# Altium schematic sheet inverter.SchDoc: 3-Phase MOSFET Driver
size A3; SheetNumber: 7; SheetTotal: 18
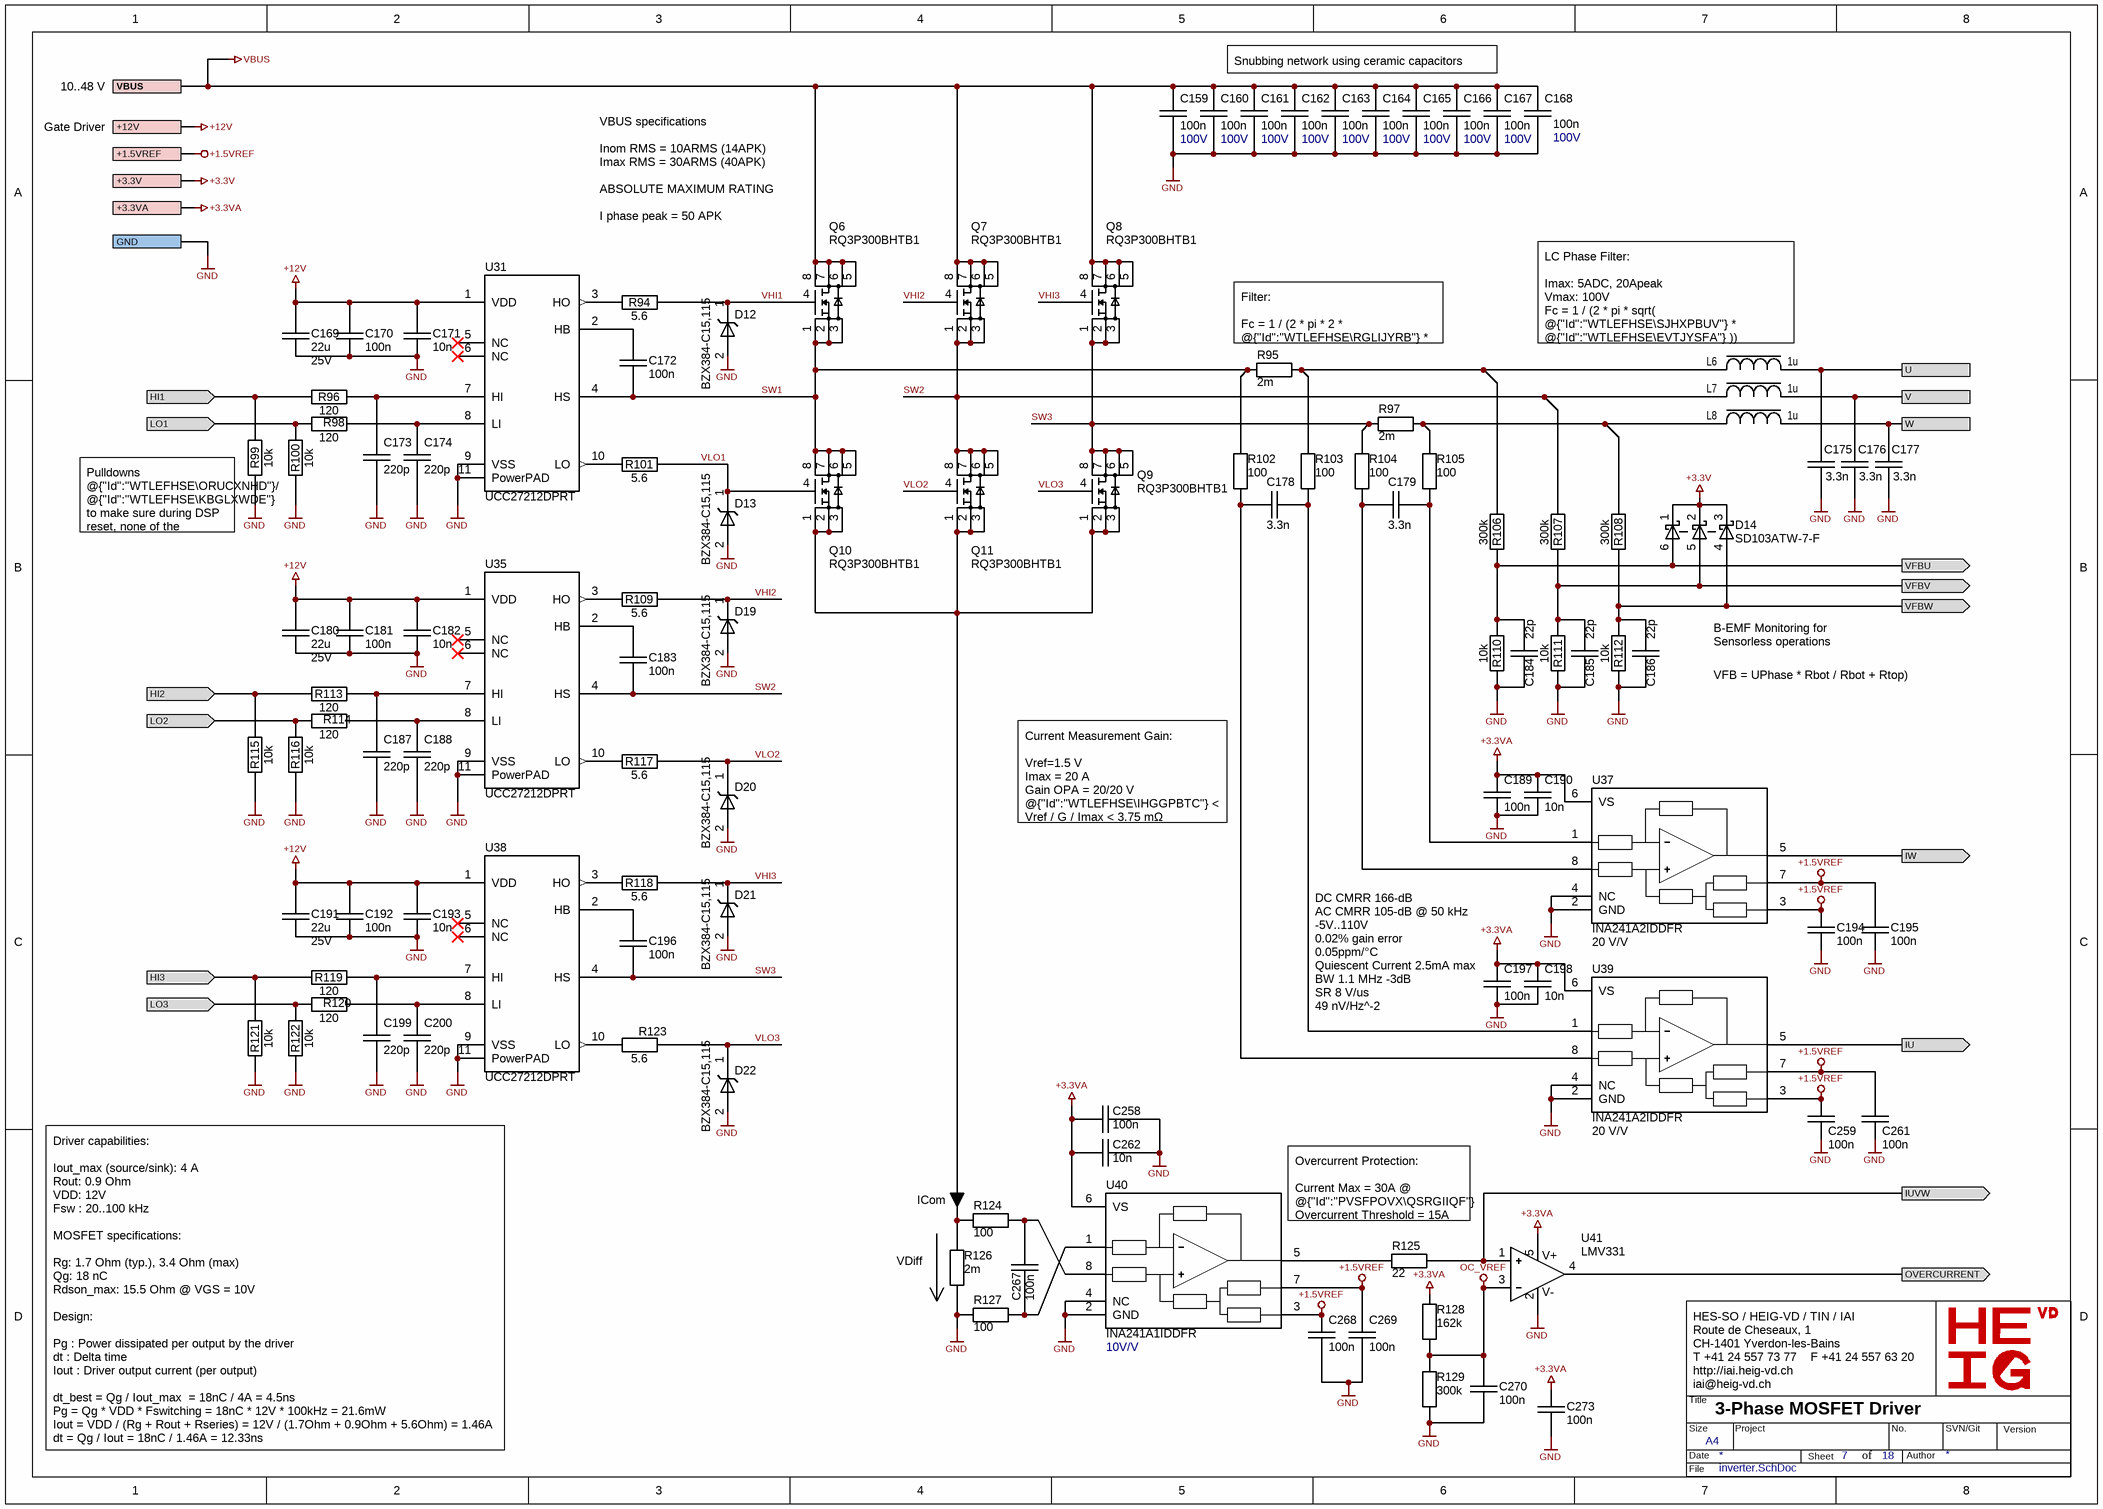
[diagram p0: inverter.SchDoc]

## Parts
C159  100n  Voltage: 100V  [SM/C1206]
C160  100n  Voltage: 100V  [SM/C1206]
C161  100n  Voltage: 100V  [SM/C1206]
C162  100n  Voltage: 100V  [SM/C1206]
C163  100n  Voltage: 100V  [SM/C1206]
C164  100n  Voltage: 100V  [SM/C1206]
C165  100n  Voltage: 100V  [SM/C1206]
C166  100n  Voltage: 100V  [SM/C1206]
C167  100n  Voltage: 100V  [SM/C1206]
C168  100n  Voltage: 100V  [SM/C1206]
C169  22u  Voltage: 25V  [SM/C0805]
C170  100n  [SM/C0402]
C171  10n  [SM/C0402]
C172  100n  [SM/C0402]
C173  220p  [SM/C0402]
C174  220p  [SM/C0402]
C175  3.3n  [SM/C0402]
C176  3.3n  [SM/C0402]
C177  3.3n  [SM/C0402]
C178  3.3n  [SM/C0402]
C179  3.3n  [SM/C0402]
C180  22u  Voltage: 25V  [SM/C0805]
C181  100n  [SM/C0402]
C182  10n  [SM/C0402]
C183  100n  [SM/C0402]
C184  22p  [SM/C0402]
C185  22p  [SM/C0402]
C186  22p  [SM/C0402]
C187  220p  [SM/C0402]
C188  220p  [SM/C0402]
C189  100n  [SM/C0402]
C190  10n  [SM/C0402]
C191  22u  Voltage: 25V  [SM/C0805]
C192  100n  [SM/C0402]
C193  10n  [SM/C0402]
C194  100n  [SM/C0402]
C195  100n  [SM/C0402]
C196  100n  [SM/C0402]
C197  100n  [SM/C0402]
C198  10n  [SM/C0402]
C199  220p  [SM/C0402]
C200  220p  [SM/C0402]
C258  100n  [SM/C0402]
C259  100n  [SM/C0402]
C261  100n  [SM/C0402]
C262  10n  [SM/C0402]
C267  100n  [SM/C0402]
C268  100n  [SM/C0402]
C269  100n  [SM/C0402]
C270  100n  [SM/C0402]
C273  100n  [SM/C0402]
D12  BZX384-C15,115  [SODFL250X110-2N]
D13  BZX384-C15,115  [SODFL250X110-2N]
D14  SD103ATW-7-F  [SC70-6]
D19  BZX384-C15,115  [SODFL250X110-2N]
D20  BZX384-C15,115  [SODFL250X110-2N]
D21  BZX384-C15,115  [SODFL250X110-2N]
D22  BZX384-C15,115  [SODFL250X110-2N]
L6  1u  [PA5005.102NLT]
L7  1u  [PA5005.102NLT]
L8  1u  [PA5005.102NLT]
Q6  RQ3P300BHTB1  [RQ3P300BHTB1]
Q7  RQ3P300BHTB1  [RQ3P300BHTB1]
Q8  RQ3P300BHTB1  [RQ3P300BHTB1]
Q9  RQ3P300BHTB1  [RQ3P300BHTB1]
Q10  RQ3P300BHTB1  [RQ3P300BHTB1]
Q11  RQ3P300BHTB1  [RQ3P300BHTB1]
R94  5.6  [SM/R0402]
R95  2m  [SM/R1206]
R96  120  [SM/R0402]
R97  2m  [SM/R1206]
R98  120  [SM/R0402]
R99  10k  [SM/R0402]
R100  10k  [SM/R0402]
R101  5.6  [SM/R0402]
R102  100  [SM/R0402]
R103  100  [SM/R0402]
R104  100  [SM/R0402]
R105  100  [SM/R0402]
R106  300k  [SM/R0402]
R107  300k  [SM/R0402]
R108  300k  [SM/R0402]
R109  5.6  [SM/R0402]
R110  10k  [SM/R0402]
R111  10k  [SM/R0402]
R112  10k  [SM/R0402]
R113  120  [SM/R0402]
R114  120  [SM/R0402]
R115  10k  [SM/R0402]
R116  10k  [SM/R0402]
R117  5.6  [SM/R0402]
R118  5.6  [SM/R0402]
R119  120  [SM/R0402]
R120  120  [SM/R0402]
R121  10k  [SM/R0402]
R122  10k  [SM/R0402]
R123  5.6  [SM/R0402]
R124  100  [SM/R0402]
R125  22  [SM/R0402]
R126  2m  [SM/R1206]
R127  100  [SM/R0402]
R128  162k  [SM/R0402]
R129  300k  [SM/R0402]
U31  UCC27212DPRT  [PSON80P400X80_HS-11N]
U35  UCC27212DPRT  [PSON80P400X80_HS-11N]
U37  INA241A2IDDFR  Gain: 20 V/V  [SOT65P280X110-8N]
U38  UCC27212DPRT  [PSON80P400X80_HS-11N]
U39  INA241A2IDDFR  Gain: 20 V/V  [SOT65P280X110-8N]
U40  INA241A1IDDFR  Gain: 10V/V  [SOT65P280X110-8N]
U41  LMV331  [SOT23-5]

## Ports
+1.5VREF, +3.3V, +3.3VA, +12V, GND, HI1 (in), HI2 (in), HI3 (in), IU (out), IUVW (out), IW (out), LO1 (in), LO2 (in), LO3 (in), OVERCURRENT (out), U, V, VBUS, VFBU (out), VFBV (out), VFBW (out), W

## Nets
+1.5VREF: C194.2 C195.2 C259.2 C261.2 C268.2 C269.2 U37.3(REF2) U37.7(REF1) U39.3(REF2) U39.7(REF1) U40.3(REF2) U40.7(REF1) ; port +1.5VREF
+3.3V: D14.1(K) D14.2(K) D14.3(K) ; port +3.3V
+3.3VA: C189.2 C190.1 C197.2 C198.1 C258.2 C262.1 C273.2 R128.2 U37.6(VS) U39.6(VS) U40.6(VS) U41.5(V+) ; port +3.3VA
+12V: C169.2 C170.2 C171.1 C180.2 C181.2 C182.1 C191.2 C192.2 C193.1 U31.1(VDD) U35.1(VDD) U38.1(VDD) ; port +12V
GND: C159.1 C160.1 C161.1 C162.1 C163.1 C164.1 C165.1 C166.1 C167.1 C168.1 C169.1 C170.1 C171.2 C173.1 C174.1 C175.1 C176.1 C177.1 C180.1 C181.1 C182.2 C184.1 C185.1 C186.1 C187.1 C188.1 C189.1 C190.2 C191.1 C192.1 C193.2 C194.1 C195.1 C197.1 C198.2 C199.1 C200.1 C258.1 C259.1 C261.1 C262.2 C268.1 C269.1 C270.1 C273.1 D12.2(A) D13.2(A) D19.2(A) D20.2(A) D21.2(A) D22.2(A) R99.2 R100.2 R110.1 R111.1 R112.1 R115.2 R116.2 R121.2 R122.2 R126.1 R127.2 R129.1 U31.9(VSS) U31.11(PowerPAD) U35.9(VSS) U35.11(PowerPAD) U37.2(GND) U37.4(NC) U38.9(VSS) U38.11(PowerPAD) U39.2(GND) U39.4(NC) U40.2(GND) U40.4(NC) U41.2(V-) ; port GND
OC_VREF: C270.2 R128.1 R129.2 U41.3(IN-)
VBUS: C159.2 C160.2 C161.2 C162.2 C163.2 C164.2 C165.2 C166.2 C167.2 C168.2 Q6.5(D) Q6.6(D) Q6.7(D) Q6.8(D) Q7.5(D) Q7.6(D) Q7.7(D) Q7.8(D) Q8.5(D) Q8.6(D) Q8.7(D) Q8.8(D) ; port VBUS
HI1: R96.2 R99.1 ; port HI1
HI2: R113.2 R115.1 ; port HI2
HI3: R119.2 R121.1 ; port HI3
IU: U39.5(OUT) ; port IU
IUVW: R125.1 U41.1(IN+) ; port IUVW
IW: U37.5(OUT) ; port IW
LO1: R98.2 R100.1 ; port LO1
LO2: R114.2 R116.1 ; port LO2
LO3: R120.2 R122.1 ; port LO3
OVERCURRENT: U41.4(OUT) ; port OVERCURRENT
SW1: C172.2 Q6.1(S) Q6.2(S) Q6.3(S) Q10.5(D) Q10.6(D) Q10.7(D) Q10.8(D) R95.1 R102.2 U31.4(HS)
SW2: C183.2 L7.1 Q7.1(S) Q7.2(S) Q7.3(S) Q11.5(D) Q11.6(D) Q11.7(D) Q11.8(D) R107.2 U35.4(HS)
SW3: C196.2 Q8.1(S) Q8.2(S) Q8.3(S) Q9.5(D) Q9.6(D) Q9.7(D) Q9.8(D) R97.1 R104.2 U38.4(HS)
U: C175.2 L6.2 ; port U
V: C176.2 L7.2 ; port V
VFBU: C184.2 D14.6(A) R106.1 R110.2 ; port VFBU
VFBV: C185.2 D14.5(A) R107.1 R111.2 ; port VFBV
VFBW: C186.2 D14.4(A) R108.1 R112.2 ; port VFBW
VHI1: D12.1(K) Q6.4(G) R94.2
VHI2: D19.1(K) Q7.4(G) R109.2
VHI3: D21.1(K) Q8.4(G) R118.2
VLO1: D13.1(K) Q10.4(G) R101.1
VLO2: D20.1(K) Q11.4(G) R117.1
VLO3: D22.1(K) Q9.4(G) R123.1
W: C177.2 L8.2 ; port W
NetC172_1: C172.1 U31.2(HB)
NetC173_2: C173.2 R96.1 U31.7(HI)
NetC174_2: C174.2 R98.1 U31.8(LI)
NetC178_1: C178.1 R102.1 U39.8(IN+)
NetC178_2: C178.2 R103.1 U39.1(IN-)
NetC179_1: C179.1 R104.1 U37.8(IN+)
NetC179_2: C179.2 R105.1 U37.1(IN-)
NetC183_1: C183.1 U35.2(HB)
NetC187_2: C187.2 R113.1 U35.7(HI)
NetC188_2: C188.2 R114.1 U35.8(LI)
NetC196_1: C196.1 U38.2(HB)
NetC199_2: C199.2 R119.1 U38.7(HI)
NetC200_2: C200.2 R120.1 U38.8(LI)
NetC267_1: C267.1 R127.1 U40.1(IN-)
NetC267_2: C267.2 R124.1 U40.8(IN+)
NetL6_1: L6.1 R95.2 R103.2 R106.2
NetL8_1: L8.1 R97.2 R105.2 R108.2
NetQ9_1: Q9.1(S) Q9.2(S) Q9.3(S) Q10.1(S) Q10.2(S) Q10.3(S) Q11.1(S) Q11.2(S) Q11.3(S) R124.2 R126.2
NetR94_1: R94.1 U31.3(HO)
NetR101_2: R101.2 U31.10(LO)
NetR109_1: R109.1 U35.3(HO)
NetR117_2: R117.2 U35.10(LO)
NetR118_1: R118.1 U38.3(HO)
NetR123_2: R123.2 U38.10(LO)
NetR125_2: R125.2 U40.5(OUT)

Not connected (* = marked no-connect by the designer): U31 5(NC)* 6(NC)*; U35 5(NC)* 6(NC)*; U38 5(NC)* 6(NC)*

## Notes on the sheet
- 10..48 V
- Snubbing network using ceramic capacitors
- Gate Driver
- VBUS specifications
  Inom RMS = 10ARMS (14APK)
  Imax RMS = 30ARMS (40APK)
  ABSOLUTE MAXIMUM RATING
  I phase peak = 50 APK
- (near R95) Filter:
  Fc = 1 / (2 * pi * 2 * @{"Id":"WTLEFHSE\RGLIJYRB"} * @{"Id":"WTLEFHSE\LUPZFQRW"} )
- (near L6) LC Phase Filter:
  Imax: 5ADC, 20Apeak
  Vmax: 100V
  Fc = 1 / (2 * pi * sqrt( @{"Id":"WTLEFHSE\SJHXPBUV"} * @{"Id":"WTLEFHSE\EVTJYSFA"} ))
  Fc = 1 / (2 * pi * sqrt(1uH * 3.3nF)) = 2.7MHz
- (near R99) Pulldowns @{"Id":"WTLEFHSE\ORUCXNHD"}/ @{"Id":"WTLEFHSE\KBGLXWDE"} to make sure during DSP reset, none of the MOSFET would be ON.
- VFB = UPhase * Rbot / Rbot + Rtop)
- B-EMF Monitoring for Sensorless operations
- Current Measurement Gain:
  Vref=1.5 V
  Imax = 20 A
  Gain OPA = 20/20 V
  @{"Id":"WTLEFHSE\IHGGPBTC"} < Vref / G / Imax < 3.75 mΩ
- (near C197) DC CMRR 166-dB
  AC CMRR 105-dB @ 50 kHz
  -5V..110V
  0.02% gain error
  0.05ppm/°C
  Quiescent Current 2.5mA max
  BW 1.1 MHz -3dB
  SR 8 V/us
  49 nV/Hz^-2
- (near R126) VDiff
- ICom
- (near U40) Overcurrent Protection:
  Current Max = 30A @ @{"Id":"PVSFPOVX\QSRGIIQF"}
  Overcurrent Threshold = 15A
- Driver capabilities:
  Iout_max (source/sink): 4 A
  Rout: 0.9 Ohm
  VDD: 12V
  Fsw : 20..100 kHz
  MOSFET specifications:
  Rg: 1.7 Ohm (typ.), 3.4 Ohm (max)
  Qg: 18 nC
  Rdson_max: 15.5 Ohm @ VGS = 10V
  Design:
  Pg : Power dissipated per output by the driver
  dt : Delta time
  Iout : Driver output current (per output)
  dt_best = Qg / Iout_max  = 18nC / 4A = 4.5ns
  Pg = Qg * VDD * Fswitching = 18nC * 12V * 100kHz = 21.6mW
  Iout = VDD / (Rg + Rout + Rseries) = 12V / (1.7Ohm + 0.9Ohm + 5.6Ohm) = 1.46A
  dt = Qg / Iout = 18nC / 1.46A = 12.33ns
- HES-SO / HEIG-VD / TIN / IAI
  Route de Cheseaux, 1
  CH-1401 Yverdon-les-Bains
  T +41 24 557 73 77    F +41 24 557 63 20
  http://iai.heig-vd.ch
  iai@heig-vd.ch
- Title
- Size
- Date
- A4
- Project
- Sheet
- of
- No.
- Author
- SVN/Git
- Version
- File

## Library data of the parts
C159-C168 = CAP CER 100NF 100V C0G 1206: 100 nF ±5% 100V Ceramic Capacitor C0G, NP0 1206 (3216 Metric); Dielectric: NPO; Supplier 1: Digi-Key; Supplier Part Number 1: 445-172677-1-ND; Value: 100n
C169 C180 C191 = CAP CER 22UF 25V X5R 0805: 22 µF ±20% 25V Ceramic Capacitor X5R 0805 (2012 Metric); Dielectric: X5R; Supplier 1: Digi-Key; Supplier Part Number 1: 490-14661-1-ND
C170 C172 C181 C183 C189 C192 C194-C197 C258 C259 C261 C267-C270 C273 = CAP CER 100NF 25V X5R 0402: 100 nF ±10% 25V Ceramic Capacitor X5R 0402 (1005 Metric); Voltage: 25V; Dielectric: X5R; Supplier 1: Digi-Key; Supplier Part Number 1: 1276-1043-1-ND; Value: 100n
C171 C182 C190 C193 C198 C262 = CAP CER 10NF 50V X7R 0402: 10 nF ±10% 50V Ceramic Capacitor X7R 0402 (1005 Metric); Voltage: 50V; Dielectric: X7R; Supplier 1: Digi-Key; Supplier Part Number 1: 1276-1028-1-ND; Value: 10n
C173 C174 C187 C188 C199 C200 = CAP CER 220PF 50V C0G/NP0 0402: 220 pF ±5% 50V Ceramic Capacitor C0G, NP0 0402 (1005 Metric); Dielectric: NPO; Voltage: 50V; Supplier 1: Digi-Key; Supplier Part Number 1: 1276-1059-1-ND; Value: 220p
C175-C179 = CAP CER 3.3NF 100V X8R 0402: 3.3 nF ±10% 100V Ceramic Capacitor X8R 0402 (1005 Metric); Voltage: 16V; Dielectric: X7R; Supplier 1: Digi-Key; Supplier Part Number 1: 445-15951-1-ND; Value: 3.3n
C184-C186 = CAP CER 22PF 50V C0G/NPO 0402: 22 pF ±2% 50V Ceramic Capacitor C0G, NP0 0402 (1005 Metric); Dielectric: NPO; Voltage: 50V; Supplier 1: Digi-Key; Supplier Part Number 1: 311-1652-1-ND; Value: 22p
D12 D13 D19-D22 = DIODE ZENER 15V 300MW SOD323: Zener Diode 15 V 300 mW ±5% Surface Mount SOD-323; Mounting: SMD; Supplier 1: Digi-Key; Supplier Part Number 1: 1727-4986-1-ND
D14 = SD103ATW-7-F: DIODE ARRAY SCHOTTKY 40V SOT363 / Diode Array 3 Independent Schottky 40 V 175mA Surface Mount 6-TSSOP, SC-88, SOT-363; Supplier 1: Digi-Key; Supplier Part Number 1: SD103ATW-FDICT-ND
L6-L8 = PA5005.102NLT: 1 µH Shielded Molded Inductor 20 A 4.52mOhm Max Nonstandard; Isat: 23A; Value: 1u; Supplier 1: Digi-Key; Supplier Part Number 1: 553-4098-1-ND
Q6-Q11 = RQ3P300BHTB1: N-Channel 100 V 39A (Ta) 2W (Ta) Surface Mount 8-HSMT (3.2x3); Supplier 1: Digi-Key; Supplier Part Number 1: 846-RQ3P300BHTB1CT-ND
R94 R101 R109 R117 R118 R123 = RES 5.6 OHM 5% 1/16W 0402: 5.6 Ohms ±5% 0.063W, 1/16W Chip Resistor 0402 (1005 Metric) Moisture Resistant Thick Film; Supplier 1: Digi-Key; Supplier Part Number 1: 311-5.6JRCT-ND; Value: 5.6
R95 R97 R126 = RES 0.002 OHM 1% 1W 1206: 2 mOhms ±1% 1W Chip Resistor 1206 (3216 Metric) Current Sense, Moisture Resistant Metal Element; Supplier 1: Digi-Key; Supplier Part Number 1: CSNL1206FT2L00CT-ND; Value: 2m
R96 R98 R113 R114 R119 R120 = RES 120 OHM 1% 1/16W 0402: 120 Ohms ±1% 0.063W, 1/16W Chip Resistor 0402 (1005 Metric) Moisture Resistant Thick Film; Supplier 1: Digi-Key; Supplier Part Number 1: 311-120LRCT-ND; Value: 120
R99 R100 R110-R112 R115 R116 R121 R122 = RES 10K OHM 1% 1/16W 0402: 10 kOhms ±1% 0.063W, 1/16W Chip Resistor 0402 (1005 Metric) Moisture Resistant Thick Film; Supplier 1: Digi-Key; Supplier Part Number 1: 1276-3431-1-ND; Value: 10k
R102-R105 R124 R127 = RES 100 OHM 1% 1/16W 0402: 100 Ohms ±1% 0.063W, 1/16W Chip Resistor 0402 (1005 Metric) Moisture Resistant Thick Film; Supplier 1: Digi-Key; Supplier Part Number 1: 13-RC0402FR-13100RLCT-ND; Value: 100
R106-R108 R129 = RES 300K OHM 1% 1/16W 0402: 300 kOhms ±1% 0.063W, 1/16W Chip Resistor 0402 (1005 Metric) Moisture Resistant Thick Film; Value: 300k; Supplier 1: Digi-Key; Supplier Part Number 1: 311-300KLRCT-ND
R125 = RES 22 OHM 1% 1/16W 0402: 22 Ohms ±1% 0.063W, 1/16W Chip Resistor 0402 (1005 Metric) Moisture Resistant Thick Film; Value: 22; Supplier 1: Digi-Key; Supplier Part Number 1: 311-22.0LRCT-ND
R128 = RES 162K OHM 1% 1/16W 0402: 162 kOhms ±1% 0.063W, 1/16W Chip Resistor 0402 (1005 Metric) Moisture Resistant Thick Film; Supplier 1: Digi-Key; Supplier Part Number 1: YAG2370CT-ND; Value: 162k
U31 U35 U38 = UCC27212: Half-Bridge Gate Driver IC Non-Inverting 10-WSON (4x4); Supplier 1: Digi-Key; Supplier Part Number 1: 296-47091-1-ND
U37 U39 = INA241A2IDDFR: Current Sense Amplifier 1 Circuit Single-Ended TSOT-23-8; Supplier 1: Digi-Key; Supplier Part Number 1: 296-INA241A2IDDFRDKR-ND
U40 = INA241A1IDDFR: Current Sense Amplifier 10V/V  1 Circuit Single-Ended TSOT-23-8; Supplier 1: Digi-Key; Supplier Part Number 1: 296-INA241A1IDDFRCT-ND
U41 = LM331: Comparator General Purpose CMOS, Open-Collector, TTL SOT-23-5; Supplier 1: Digi-Key; Supplier Part Number 1: 296-6633-1-ND